# Altium schematic sheet electro3_sensor.SchDoc
size A4
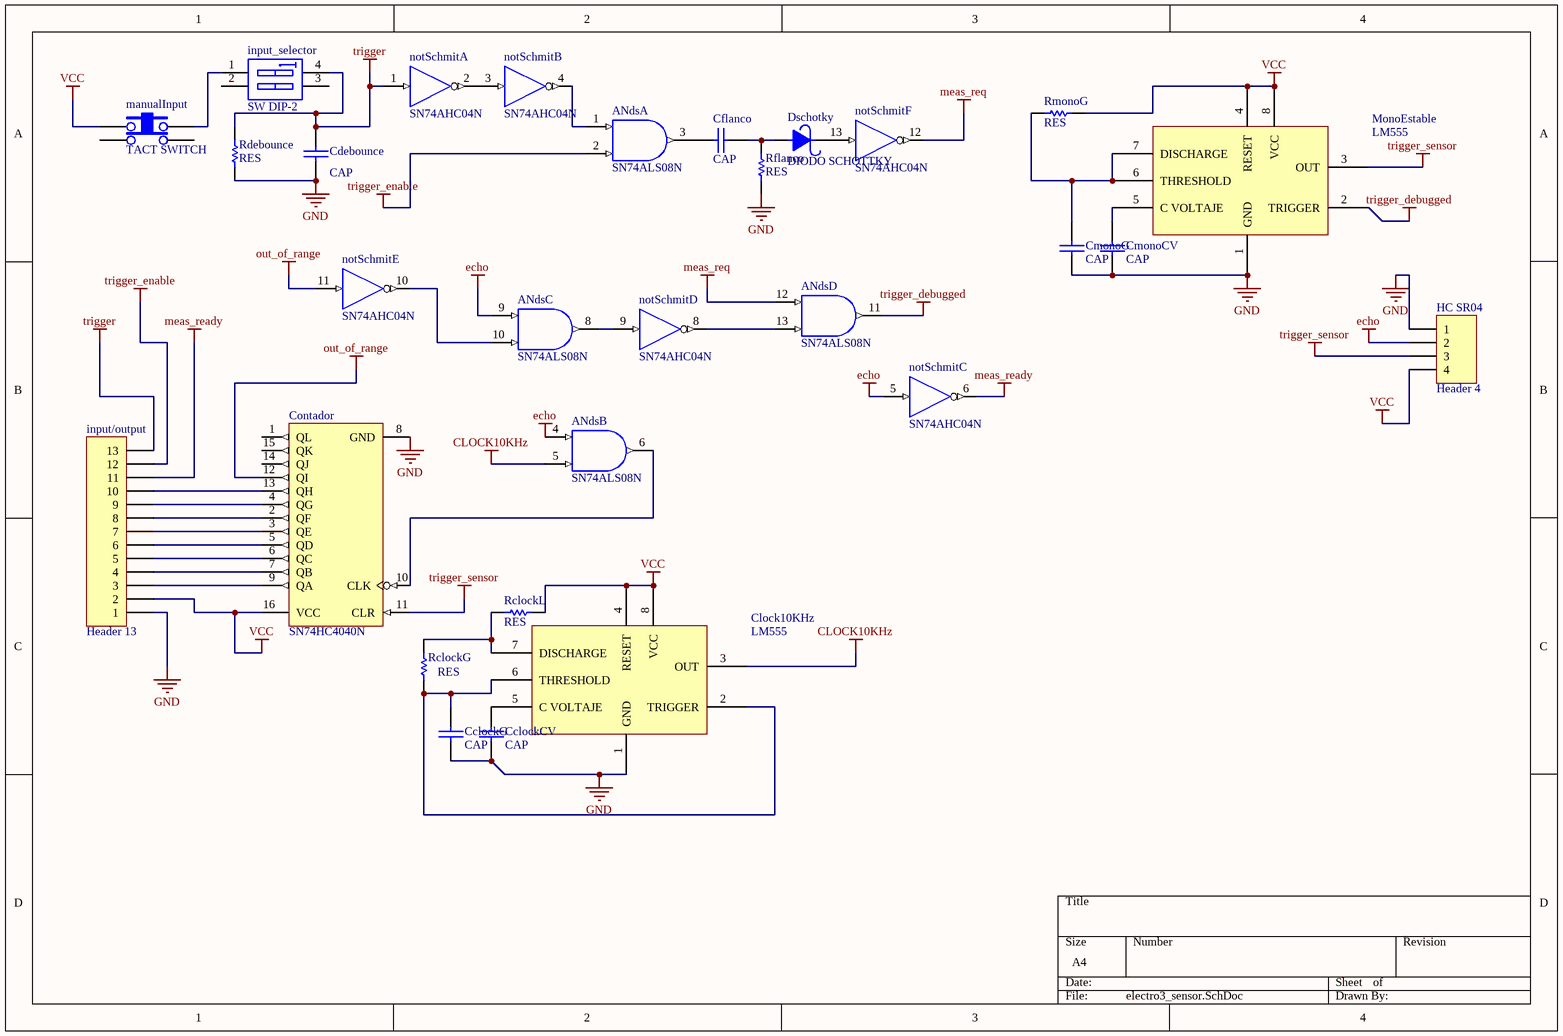
[diagram p0: electro3_sensor.SchDoc]

## Parts
ANds  SN74ALS08N  [N014]  (parts A,B,C,D of 4)
CclockCV  CAP  [CAP200]
CclockG  CAP  [CAP200]
Cdebounce  CAP  [CAP200]
Cflanco  CAP  [CAP200]
Clock10KHz  LM555  [DIP8]
CmonoCV  CAP  [CAP200]
CmonoG  CAP  [CAP200]
Contador  SN74HC4040N  [N016]
Dschotky  DIODO SCHOTTKY  [DO41]
HC_SR04  Header 4  [HDR1X4]
input/output  Header 13  [HDR1X13]
input_selector  SW DIP-2  [DIP-4]
manualInput  TACT SWITCH  [TACTSWITCH]
MonoEstable  LM555  [DIP8]
notSchmit  SN74AHC04N  [N014]  (parts A,B,C,D,E,F of 6)
RclockG  RES  [RES400]
RclockL  RES  [RES400]
Rdebounce  RES  [RES400]
Rflanco  RES  [RES400]
RmonoG  RES  [RES400]

## Nets
CLOCK10KHz: ANds.5(B) Clock10KHz.3(OUT)
echo: ANds.4(A) ANds.9(A) HC_SR04.2 notSchmit.5(A)
GND: ANds.7(GND) CclockCV.2 CclockG.2 Cdebounce.2 Clock10KHz.1(GND) CmonoCV.2 CmonoG.2 Contador.8(GND) HC_SR04.1 input/output.1 MonoEstable.1(GND) notSchmit.7(GND) Rdebounce.1 Rflanco.1
meas_ready: input/output.11 notSchmit.6(Y)
meas_req: ANds.12(A) notSchmit.12(Y)
out_of_range: Contador.12(QI) notSchmit.11(A)
trigger: Cdebounce.1 input/output.13 input_selector.4(B1) notSchmit.1(A) Rdebounce.2
trigger_debugged: ANds.11(Y) MonoEstable.2(TRIGGER)
trigger_enable: ANds.2(B) input/output.12
trigger_sensor: Contador.11(CLR) HC_SR04.3 MonoEstable.3(OUT)
VCC: ANds.14(VCC) Clock10KHz.4(RESET) Clock10KHz.8(VCC) Contador.16(VCC) HC_SR04.4 input/output.2 manualInput.1 MonoEstable.4(RESET) MonoEstable.8(VCC) notSchmit.14(VCC) RclockL.2 RmonoG.2
NetANds_1: ANds.1(A) notSchmit.4(Y)
NetANds_3: ANds.3(Y) Cflanco.1
NetANds_6: ANds.6(Y) Contador.10(CLK)
NetANds_8: ANds.8(Y) notSchmit.9(A)
NetANds_10: ANds.10(B) notSchmit.10(Y)
NetANds_13: ANds.13(B) notSchmit.8(Y)
NetCclockCV_1: CclockCV.1 Clock10KHz.5(C_VOLTAJE)
NetCclockG_1: CclockG.1 Clock10KHz.2(TRIGGER) Clock10KHz.6(THRESHOLD) RclockG.1
NetCflanco_2: Cflanco.2 Dschotky.1 Rflanco.2
NetClock10KHz_7: Clock10KHz.7(DISCHARGE) RclockG.2 RclockL.1
NetCmonoCV_1: CmonoCV.1 MonoEstable.5(C_VOLTAJE)
NetCmonoG_1: CmonoG.1 MonoEstable.6(THRESHOLD) MonoEstable.7(DISCHARGE) RmonoG.1
NetContador_2: Contador.2(QF) input/output.8
NetContador_3: Contador.3(QE) input/output.7
NetContador_4: Contador.4(QG) input/output.9
NetContador_5: Contador.5(QD) input/output.6
NetContador_6: Contador.6(QC) input/output.5
NetContador_7: Contador.7(QB) input/output.4
NetContador_9: Contador.9(QA) input/output.3
NetContador_13: Contador.13(QH) input/output.10
NetDschotky_2: Dschotky.2 notSchmit.13(A)
Netinput_selector_1: input_selector.1(A1) manualInput.3
NetnotSchmit_2: notSchmit.2(Y) notSchmit.3(A)

Not connected (* = marked no-connect by the designer): Contador 1(QL) 14(QJ) 15(QK); input_selector 2(A2) 3(B2); manualInput 2 4

## Library data of the parts
ANds = SN74ALS08N: Quadruple 2-Input Positive-AND Gate; Published: 8-Jun-2000; LatestRevisionDate: 04-Mar-2005; LatestRevisionNote: Stylized 3D Model Added.; DatasheetVersion: Dec-1994; PackageVersion: Oct-1995; PackageReference: N014; Publisher: Altium Limited; PackageDescription: DIP; 14 Leads; Row Spacing 7.62 mm; Pitch 2.54 mm; ComponentLink1Description: Manufacturer Link; ComponentLink1URL: http://www.ti.com/; ComponentLink2Description: Datasheet; ComponentLink2URL: http://www-s.ti.com/sc/ds/sn74als08.pdf; ComponentLink3Description: Packaging Specification; ComponentLink3URL: http://focus.ti.com/lit/ml/mpdi002c/mpdi002c.pdf
Clock10KHz MonoEstable = LM555: Timer
Contador = SN74HC4040N: 12-Bit Asynchronous Binary Counter; Published: 8-Jun-2000; LatestRevisionDate: 04-Mar-2005; LatestRevisionNote: Stylized 3D Model Added.; DatasheetVersion: May-1997; PackageVersion: Oct-1995; PackageReference: N016; Publisher: Altium Limited; PackageDescription: DIP; 16 Leads; Row Spacing 7.62 mm; Pitch 2.54 mm; Code_JEDEC: MS-001-BB; ComponentLink1Description: Manufacturer Link; ComponentLink1URL: http://www.ti.com/; ComponentLink2Description: Datasheet; ComponentLink2URL: http://www-s.ti.com/sc/ds/sn74hc4040.pdf
HC_SR04 = Header 4: Header, 4-Pin; LatestRevisionDate: 17-Jul-2002; LatestRevisionNote: Re-released for DXP Platform.; Publisher: Altium Limited
input/output = Header 13: Header, 13-Pin; LatestRevisionDate: 17-Jul-2002; LatestRevisionNote: Re-released for DXP Platform.; Publisher: Altium Limited
input_selector = SW DIP-2: DIP Switch, 2 Position, SPST; Published: 24-Mar-1999; LatestRevisionDate: 17-Jul-2002; LatestRevisionNote: Re-released for DXP Platform.; PackageReference: DIP-4; Publisher: Altium Limited
notSchmit = SN74AHC04N: Hex Inverter; Published: 8-Jun-2000; LatestRevisionDate: 04-Mar-2005; LatestRevisionNote: Stylized 3D Model Added.; DatasheetVersion: Jun-1998; PackageVersion: Oct-1995; PackageReference: N014; Publisher: Altium Limited; PackageDescription: DIP; 14 Leads; Row Spacing 7.62 mm; Pitch 2.54 mm; ComponentLink1Description: Manufacturer Link; ComponentLink1URL: http://www.ti.com/; ComponentLink2Description: Datasheet; ComponentLink2URL: http://www-s.ti.com/sc/ds/sn74ahc04.pdf; ComponentLink3Description: Packaging Specification; ComponentLink3URL: http://focus.ti.com/lit/ml/mpdi002c/mpdi002c.pdf